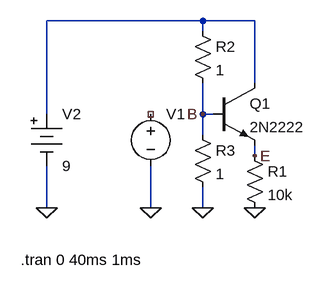
[diagram p0: schematic Emitter Follower.asc]
Emitter Follower.asc, the LTspice schematic file:
Version 4
SHEET 1 880 680
WIRE 336 176 96 176
WIRE 416 176 336 176
WIRE 336 192 336 176
WIRE 416 272 416 176
WIRE 96 320 96 176
WIRE 336 320 336 272
WIRE 352 320 336 320
WIRE 336 352 336 320
WIRE 416 384 416 368
WIRE 96 464 96 400
WIRE 256 464 256 400
WIRE 336 464 336 432
FLAG 256 464 0
FLAG 416 464 0
FLAG 96 464 0
FLAG 336 320 B
FLAG 416 384 E
FLAG 336 464 0
SYMBOL npn 352 272 R0
SYMATTR InstName Q1
SYMATTR Value 2N2222
SYMBOL voltage 256 304 R0
WINDOW 3 23 93 Invisible 2
SYMATTR InstName V1
SYMATTR Value SINE(4 4 100 0 0 0 4)
SYMBOL res 400 368 R0
SYMATTR InstName R1
SYMATTR Value 10k
SYMBOL Misc/battery 96 304 R0
SYMATTR InstName V2
SYMATTR Value 9
SYMBOL res 320 176 R0
SYMATTR InstName R2
SYMATTR Value 1
SYMBOL res 320 336 R0
SYMATTR InstName R3
SYMATTR Value 1
TEXT 56 544 Left 2 !.tran 0 40ms 1ms

The netlist it stands for:
* Emitter Follower.asc
Q1 N001 B E 0 2N2222
V1 NC_01 0 SINE(4 4 100 0 0 0 4)
R1 E 0 10k
V2 N001 0 9
R2 N001 B 1
R3 B 0 1
.model NPN NPN
.model PNP PNP
.lib standard.bjt
.tran 0 40ms 1ms
.backanno
.end